# EAGLE design illucia_dtr_teensy_v1.0 (EAGLE 5.10)
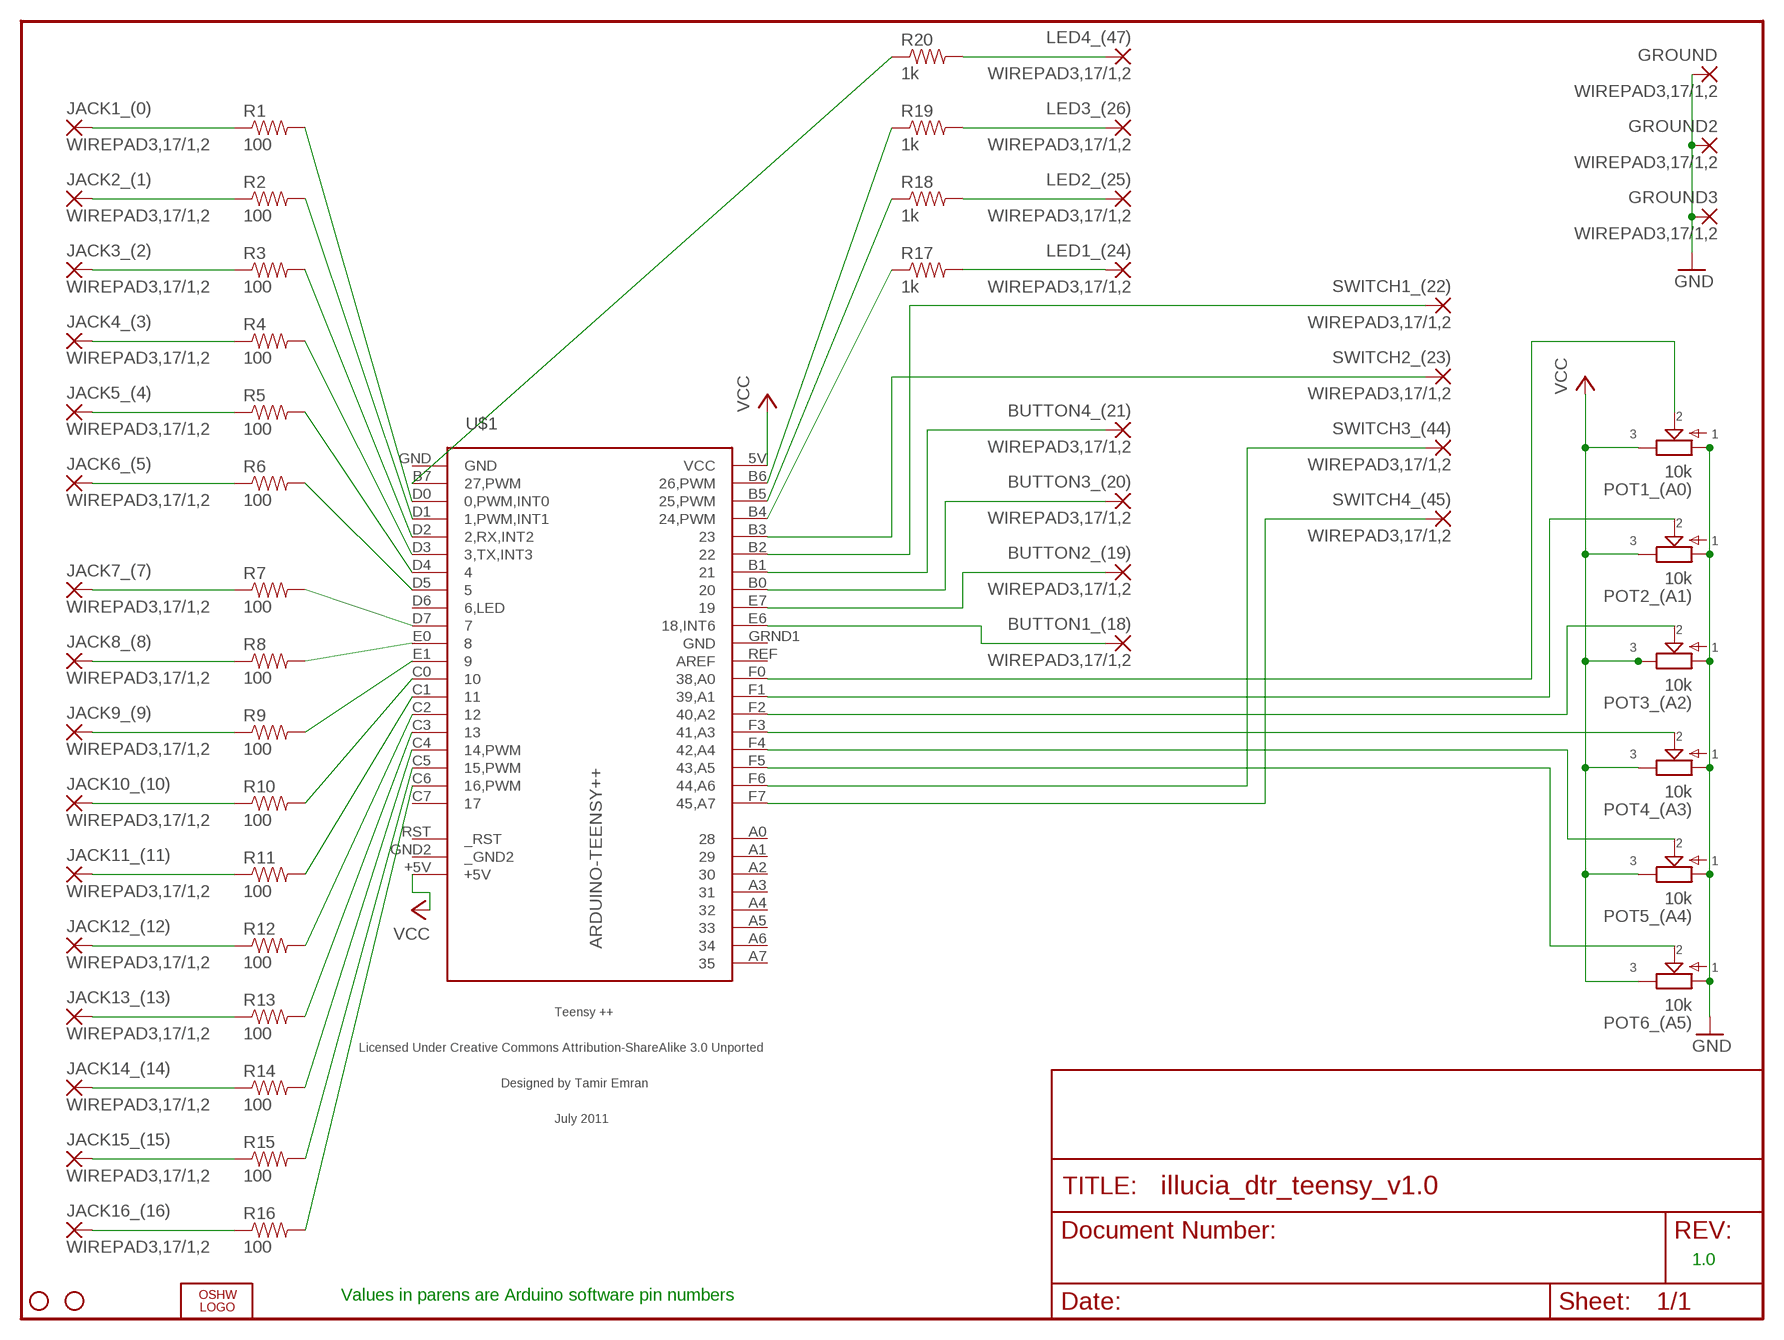
[diagram p0: schematic, sheet 1]

## Parts
BUTTON1_(18)  WIREPAD3,17/1,2  [3,17/1,2]
BUTTON2_(19)  WIREPAD3,17/1,2  [3,17/1,2]
BUTTON3_(20)  WIREPAD3,17/1,2  [3,17/1,2]
BUTTON4_(21)  WIREPAD3,17/1,2  [3,17/1,2]
GROUND  WIREPAD3,17/1,2  [3,17/1,2]
GROUND2  WIREPAD3,17/1,2  [3,17/1,2]
GROUND3  WIREPAD3,17/1,2  [3,17/1,2]
JACK1_(0)  WIREPAD3,17/1,2  [3,17/1,2]
JACK2_(1)  WIREPAD3,17/1,2  [3,17/1,2]
JACK3_(2)  WIREPAD3,17/1,2  [3,17/1,2]
JACK4_(3)  WIREPAD3,17/1,2  [3,17/1,2]
JACK5_(4)  WIREPAD3,17/1,2  [3,17/1,2]
JACK6_(5)  WIREPAD3,17/1,2  [3,17/1,2]
JACK7_(7)  WIREPAD3,17/1,2  [3,17/1,2]
JACK8_(8)  WIREPAD3,17/1,2  [3,17/1,2]
JACK9_(9)  WIREPAD3,17/1,2  [3,17/1,2]
JACK10_(10)  WIREPAD3,17/1,2  [3,17/1,2]
JACK11_(11)  WIREPAD3,17/1,2  [3,17/1,2]
JACK12_(12)  WIREPAD3,17/1,2  [3,17/1,2]
JACK13_(13)  WIREPAD3,17/1,2  [3,17/1,2]
JACK14_(14)  WIREPAD3,17/1,2  [3,17/1,2]
JACK15_(15)  WIREPAD3,17/1,2  [3,17/1,2]
JACK16_(16)  WIREPAD3,17/1,2  [3,17/1,2]
JP1  STAND-OFF  [STAND-OFF]
JP4  STAND-OFF  [STAND-OFF]
LED1_(24)  WIREPAD3,17/1,2  [3,17/1,2]
LED2_(25)  WIREPAD3,17/1,2  [3,17/1,2]
LED3_(26)  WIREPAD3,17/1,2  [3,17/1,2]
LED4_(47)  WIREPAD3,17/1,2  [3,17/1,2]
LOGO1  OSHW_LOGO_FILLX0350-NT  [OSHW_FILLX350_NOTEXT]
POT1_(A0)  10k  POT-EU16MM  [16MM]
POT2_(A1)  10k  POT-EU16MM  [16MM]
POT3_(A2)  10k  POT-EU16MM  [16MM]
POT4_(A3)  10k  POT-EU16MM  [16MM]
POT5_(A4)  10k  POT-EU16MM  [16MM]
POT6_(A5)  10k  POT-EU16MM  [16MM]
R1  100  RESISTORAXIAL-0.3  [AXIAL-0.3]
R2  100  RESISTORAXIAL-0.3  [AXIAL-0.3]
R3  100  RESISTORAXIAL-0.3  [AXIAL-0.3]
R4  100  RESISTORAXIAL-0.3  [AXIAL-0.3]
R5  100  RESISTORAXIAL-0.3  [AXIAL-0.3]
R6  100  RESISTORAXIAL-0.3  [AXIAL-0.3]
R7  100  RESISTORAXIAL-0.3  [AXIAL-0.3]
R8  100  RESISTORAXIAL-0.3  [AXIAL-0.3]
R9  100  RESISTORAXIAL-0.3  [AXIAL-0.3]
R10  100  RESISTORAXIAL-0.3  [AXIAL-0.3]
R11  100  RESISTORAXIAL-0.3  [AXIAL-0.3]
R12  100  RESISTORAXIAL-0.3  [AXIAL-0.3]
R13  100  RESISTORAXIAL-0.3  [AXIAL-0.3]
R14  100  RESISTORAXIAL-0.3  [AXIAL-0.3]
R15  100  RESISTORAXIAL-0.3  [AXIAL-0.3]
R16  100  RESISTORAXIAL-0.3  [AXIAL-0.3]
R17  1k  RESISTORAXIAL-0.3  [AXIAL-0.3]
R18  1k  RESISTORAXIAL-0.3  [AXIAL-0.3]
R19  1k  RESISTORAXIAL-0.3  [AXIAL-0.3]
R20  1k  RESISTORAXIAL-0.3  [AXIAL-0.3]
SWITCH1_(22)  WIREPAD3,17/1,2  [3,17/1,2]
SWITCH2_(23)  WIREPAD3,17/1,2  [3,17/1,2]
SWITCH3_(44)  WIREPAD3,17/1,2  [3,17/1,2]
SWITCH4_(45)  WIREPAD3,17/1,2  [3,17/1,2]
U$1  ARDUINO-TEENSY++  [TEENSY++]

## Nets
GND: GROUND2.1(P) GROUND3.1(P) GROUND.1(P) POT1_(A0).1 POT2_(A1).1 POT3_(A2).1 POT4_(A3).1 POT5_(A4).1 POT6_(A5).1
N$1: R20.P$1 U$1.B7(27,PWM)
N$2: R1.P$2 U$1.D0(0,PWM,INT0)
N$3: R3.P$2 U$1.D2(2,RX,INT2)
N$4: R4.P$2 U$1.D3(3,TX,INT3)
N$5: R5.P$2 U$1.D4
N$6: R6.P$2 U$1.D5
N$7: R7.P$2 U$1.D7
N$8: R8.P$2 U$1.E0
N$9: R9.P$2 U$1.E1
N$10: R10.P$2 U$1.C0
N$11: R11.P$2 U$1.C1
N$12: R12.P$2 U$1.C2
N$13: R2.P$2 U$1.D1(1,PWM,INT1)
N$14: R13.P$2 U$1.C3
N$15: R14.P$2 U$1.C4(14,PWM)
N$16: R15.P$2 U$1.C5(15,PWM)
N$17: R16.P$2 U$1.C6(16,PWM)
N$18: R19.P$1 U$1.B6(26,PWM)
N$19: R18.P$1 U$1.B5(25,PWM)
N$20: R17.P$1 U$1.B4(24,PWM)
N$21: LED4_(47).1(P) R20.P$2
N$22: LED3_(26).1(P) R19.P$2
N$23: LED2_(25).1(P) R18.P$2
N$24: LED1_(24).1(P) R17.P$2
N$25: POT1_(A0).2 U$1.F0(38,A0)
N$26: POT2_(A1).2 U$1.F1(39,A1)
N$27: POT3_(A2).2 U$1.F2(40,A2)
N$28: POT4_(A3).2 U$1.F3(41,A3)
N$29: POT5_(A4).2 U$1.F4(42,A4)
N$30: POT6_(A5).2 U$1.F5(43,A5)
N$31: BUTTON1_(18).1(P) U$1.E6(18,INT6)
N$32: BUTTON2_(19).1(P) U$1.E7
N$33: BUTTON3_(20).1(P) U$1.B0
N$34: BUTTON4_(21).1(P) U$1.B1
N$35: SWITCH2_(23).1(P) U$1.B3
N$36: JACK6_(5).1(P) R6.P$1
N$37: JACK7_(7).1(P) R7.P$1
N$38: JACK8_(8).1(P) R8.P$1
N$40: SWITCH1_(22).1(P) U$1.B2
N$44: JACK14_(14).1(P) R14.P$1
N$45: JACK15_(15).1(P) R15.P$1
N$46: JACK16_(16).1(P) R16.P$1
N$47: JACK1_(0).1(P) R1.P$1
N$48: JACK2_(1).1(P) R2.P$1
N$49: JACK3_(2).1(P) R3.P$1
N$50: JACK4_(3).1(P) R4.P$1
N$51: JACK5_(4).1(P) R5.P$1
N$53: SWITCH3_(44).1(P) U$1.F6(44,A6)
N$54: SWITCH4_(45).1(P) U$1.F7(45,A7)
N$55: JACK9_(9).1(P) R9.P$1
N$56: JACK10_(10).1(P) R10.P$1
N$57: JACK11_(11).1(P) R11.P$1
N$58: JACK12_(12).1(P) R12.P$1
N$59: JACK13_(13).1(P) R13.P$1
VCC: POT1_(A0).3 POT2_(A1).3 POT3_(A2).3 POT4_(A3).3 POT5_(A4).3 POT6_(A5).3 U$1.5V(VCC) U$1.+5V
Unconnected: U$1.A0 U$1.A1 U$1.A2 U$1.A3 U$1.A4 U$1.A5 U$1.A6 U$1.A7 U$1.C7 U$1.D6(6,LED) U$1.REF(AREF) U$1.RST(_RST)

## Notes on the sheet
- 1.0
- Values in parens are Arduino software pin numbers

## Power pins joined to a net without a drawn wire
_GND2: U$1.GND2(_GND2)
GND: U$1.GND U$1.GRND1(GND)

## Library data of the parts
BUTTON1_(18) BUTTON2_(19) BUTTON3_(20) BUTTON4_(21) GROUND GROUND2 GROUND3 JACK1_(0) JACK2_(1) JACK3_(2) JACK4_(3) JACK5_(4) JACK6_(5) JACK7_(7) JACK8_(8) JACK9_(9) JACK10_(10) JACK11_(11) JACK12_(12) JACK13_(13) JACK14_(14) JACK15_(15) JACK16_(16) LED1_(24) LED2_(25) LED3_(26) LED4_(47) SWITCH1_(22) SWITCH2_(23) SWITCH3_(44) SWITCH4_(45) = wirepad:WIREPAD: Wire PAD connect wire on PCB
JP1 JP4 = SparkFun:STAND-OFF: Stand Off This is the mechanical footprint for a #4 phillips button head screw. Use the keepout ring to avoid running the screw head into surrounding components. SKU : PRT-00447
LOGO1 = OSHW:OSHW_LOGO_FILL
POT1_(A0) POT2_(A1) POT3_(A2) POT4_(A3) POT5_(A4) POT6_(A5) = !parts_I_built:POT-EU
R1-R20 = SparkFun:RESISTOR: Resistor Basic schematic elements and footprints for 0603, 1206, and PTH resistors.
U$1 = !parts_I_built:ARDUINO-TEENSY++: Teensy ++ Original Design by Mark Gross Modified Design by Tamir Emran Licensed Under Creative Commons Attribution-ShareAlike 3.0 Unported (CC BY-SA 3.0)

## Board
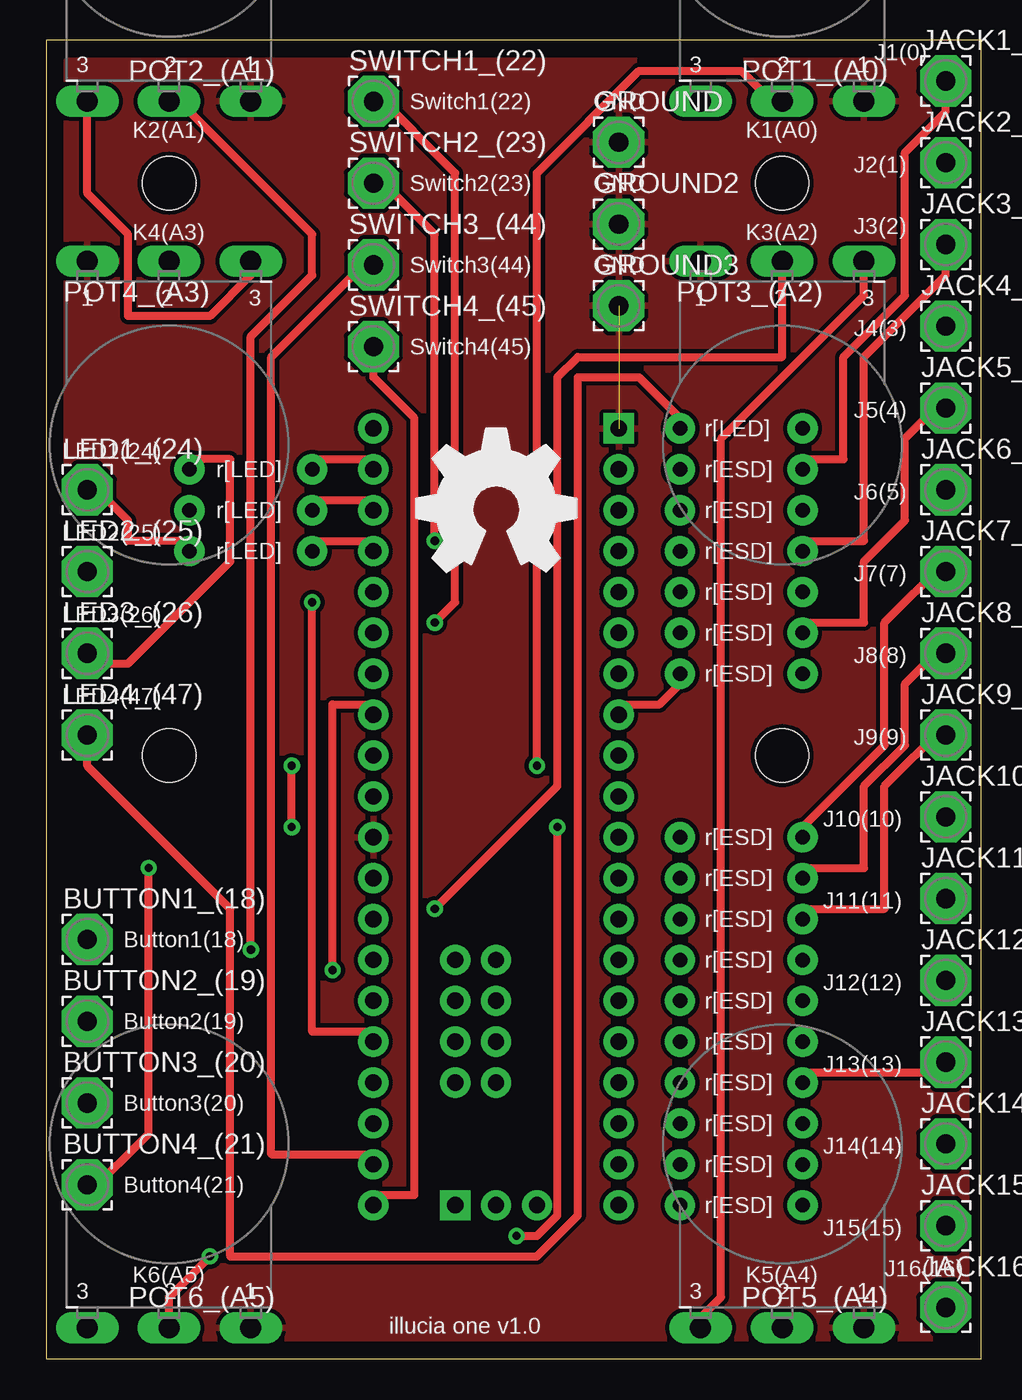
[diagram p1: board, top side]
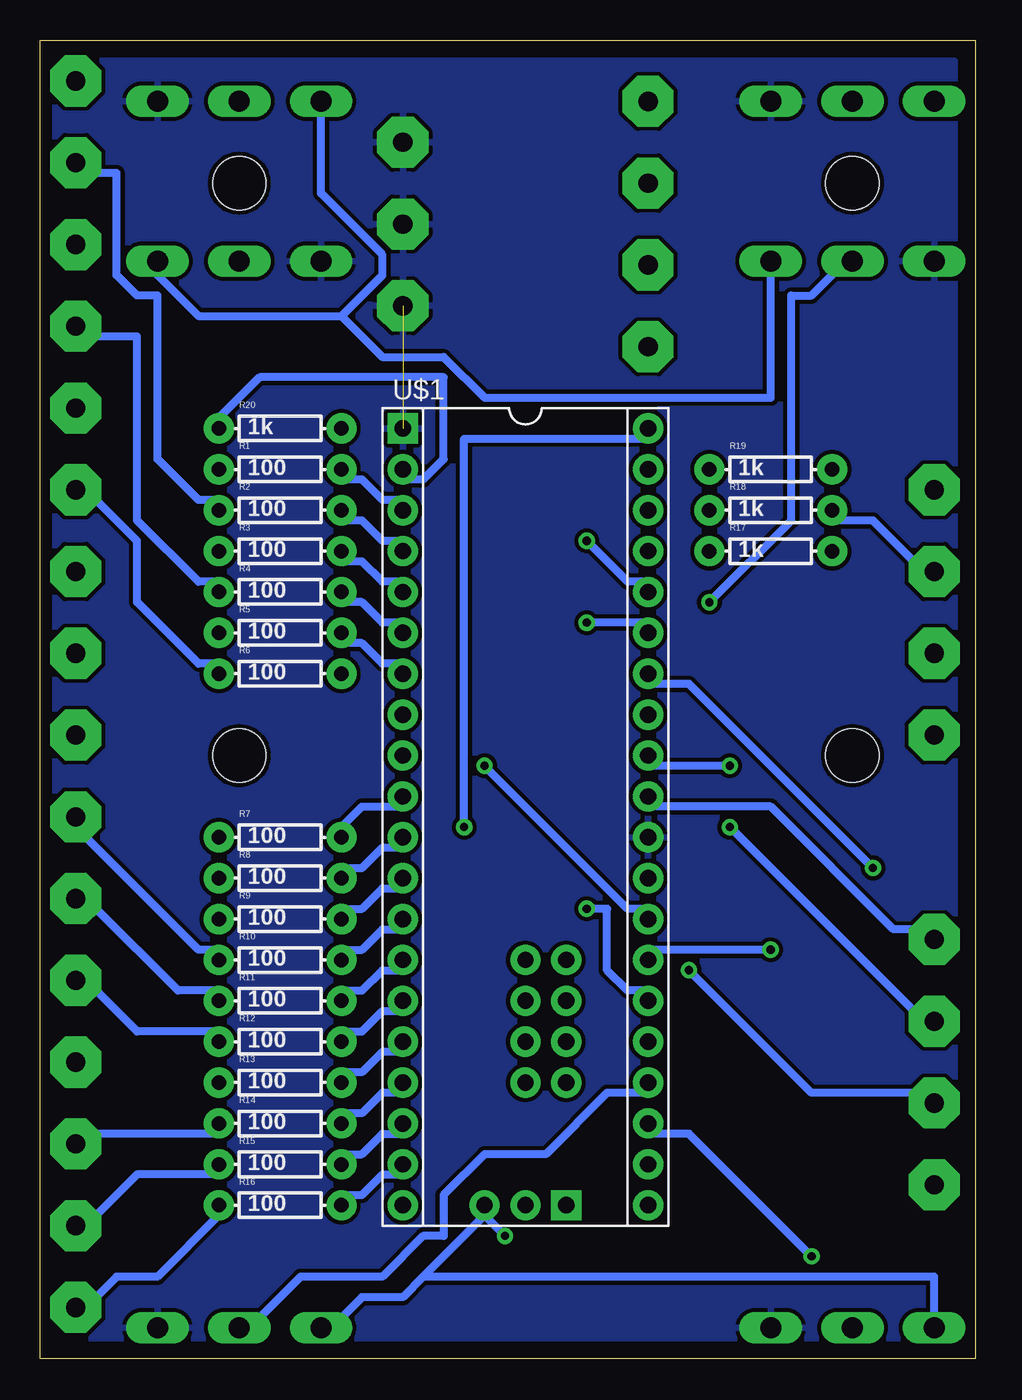
[diagram p2: board, bottom side, seen from below]

Size 58.09 x 81.91 mm. Coordinates in mm from the lower left corner, seen from the top.
Outline: 0,0 58.09,0 58.09,81.91 0,81.91 0,0
Copper layers (1*16): Top 0.035mm / dielectric 1.5mm / Bottom 0.035mm
Design rules "BatchPcb (Production) *": minimum track width 20mil, minimum drill 20mil, track to track 10mil, track to pad 10mil, pad to pad 4mil, via to via 8mil, smd to smd 4mil, copper to edge 10mil, drill to drill 8mil, minimum pad ring 12mil, minimum via ring 10mil, stop-mask expansion 4mil, vias tented up to drill 25mil, thermal gap 10mil

### Footprints (pad centres in the part's own frame; a part is rotated, then mirrored left to right if it is on the bottom)
3,17/1,2 = drill 1.194 pad 3.175 octagon: 1 0,0
STAND-OFF = hole 3.302: 0,0
16MM = drill 1.3 long: 1 5.08,0; 2 0,0; 3 -5.08,0
AXIAL-0.3 = drill 0.9 pad 1.88 round: P$1 -3.81,0; P$2 3.81,0
TEENSY++ = drill 1.016 pad 1.88 round: 5V 24.13,-2.54; +5V -24.13,7.62; A0 8.89,0; A1 11.43,0; A2 13.97,0; A3 16.51,0; A4 8.89,2.54; A5 11.43,2.54; A6 13.97,2.54; A7 16.51,2.54; B0 -6.35,7.62; B1 -8.89,7.62; B2 -11.43,7.62; B3 -13.97,7.62; B4 -16.51,7.62; B5 -19.05,7.62; B6 -21.59,7.62; B7 -21.59,-7.62; C0 6.35,-7.62; C1 8.89,-7.62; C2 11.43,-7.62; C3 13.97,-7.62; C4 16.51,-7.62; C5 19.05,-7.62; C6 21.59,-7.62; C7 24.13,-7.62; D0 -19.05,-7.62; D1 -16.51,-7.62; D2 -13.97,-7.62; D3 -11.43,-7.62; D4 -8.89,-7.62; D5 -6.35,-7.62; D6 -3.81,-7.62; D7 -1.27,-7.62; E0 1.27,-7.62; E1 3.81,-7.62; E6 -1.27,7.62; E7 -3.81,7.62; F0 6.35,7.62; F1 8.89,7.62; F2 11.43,7.62; F3 13.97,7.62; F4 16.51,7.62; F5 19.05,7.62; F6 21.59,7.62; F7 24.13,7.62; GND2 24.13,0; GRND1 1.27,7.62; REF 3.81,7.62 | drill 1.016 pad 1.88 square: GND -24.13,-7.62; RST 24.13,2.54

### Placement (x,y rotation side)
BUTTON1_(18)  2.54,26.04 0 top
BUTTON2_(19)  2.54,20.95 0 top
BUTTON3_(20)  2.54,15.88 0 top
BUTTON4_(21)  2.54,10.79 0 top
GROUND  35.56,75.56 0 top
GROUND2  35.56,70.48 0 top
GROUND3  35.56,65.41 0 top
JACK1_(0)  55.88,79.38 0 top
JACK2_(1)  55.88,74.3 0 top
JACK3_(2)  55.88,69.22 0 top
JACK4_(3)  55.88,64.14 0 top
JACK5_(4)  55.88,59.05 0 top
JACK6_(5)  55.88,53.98 0 top
JACK7_(7)  55.88,48.9 0 top
JACK8_(8)  55.88,43.81 0 top
JACK9_(9)  55.88,38.73 0 top
JACK10_(10)  55.88,33.66 0 top
JACK11_(11)  55.88,28.57 0 top
JACK12_(12)  55.88,23.5 0 top
JACK13_(13)  55.88,18.41 0 top
JACK14_(14)  55.88,13.34 0 top
JACK15_(15)  55.88,8.26 0 top
JACK16_(16)  55.88,3.17 0 top
JP1  45.72,37.47 0 top
JP2  STAND-OFF  [STAND-OFF]  7.62,73.03 0 top
JP3  STAND-OFF  [STAND-OFF]  45.72,73.03 0 top
JP4  7.62,37.47 0 top
LED1_(24)  2.54,53.98 0 top
LED2_(25)  2.54,48.9 0 top
LED3_(26)  2.54,43.81 0 top
LED4_(47)  2.54,38.73 0 top
LOGO1  22.99,48.9 0 top
POT1_(A0)  45.72,78.11 0 top
POT2_(A1)  7.62,78.11 0 top
POT3_(A2)  45.72,68.18 180 top
POT4_(A3)  7.62,68.18 180 top
POT5_(A4)  45.72,1.91 0 top
POT6_(A5)  7.62,1.91 0 top
R1  43.18,55.24 0 bottom
R2  43.18,52.7 0 bottom
R3  43.18,50.16 0 bottom
R4  43.18,47.62 0 bottom
R5  43.18,45.09 0 bottom
R6  43.18,42.55 0 bottom
R7  43.18,32.38 0 bottom
R8  43.18,29.84 0 bottom
R9  43.18,27.3 0 bottom
R10  43.18,24.77 0 bottom
R11  43.18,22.23 0 bottom
R12  43.18,19.68 0 bottom
R13  43.18,17.14 0 bottom
R14  43.18,14.61 0 bottom
R15  43.18,12.06 0 bottom
R16  43.18,9.53 0 bottom
R17  12.7,50.16 0 bottom
R18  12.7,52.7 0 bottom
R19  12.7,55.24 0 bottom
R20  43.18,57.78 0 bottom
SWITCH1_(22)  20.32,78.11 0 top
SWITCH2_(23)  20.32,73.03 0 top
SWITCH3_(44)  20.32,67.94 0 top
SWITCH4_(45)  20.32,62.87 0 top
U$1  27.94,33.66 270 bottom

### Tracks (layer width: path | path; a pad name or v marks a point on that pad's centre or on a via)
GND  (1 unrouted)
  pour Bottom: 57.15,80.64 1.27,80.64 1.27,1.27 57.15,1.27
  pour Top: 57.15,80.64 1.27,80.64 1.27,1.27 57.15,1.27
N$1
  Bottom 0.508: U$1.B7 35.56,54.61 34.29,54.61 33.02,55.88 33.02,60.96 44.45,60.96 46.99,58.42 R20.P$1
N$2
  Bottom 0.508: U$1.D0 35.56,53.34 36.83,53.34 38.1,54.61 39.37,54.61 R1.P$2
N$3
  Bottom 0.508: U$1.D2 35.56,48.26 36.83,48.26 38.1,49.53 39.37,49.53 R3.P$2
N$4
  Bottom 0.508: U$1.D3 35.56,45.72 36.83,45.72 38.1,46.99 39.37,46.99 R4.P$2
N$5
  Bottom 0.508: U$1.D4 35.56,43.18 36.83,43.18 38.1,44.45 39.37,44.45 R5.P$2
N$6
  Top 0.508: U$1.D5 35.56,40.64 38.1,40.64 39.37,41.91 R6.P$2
N$7
  Bottom 0.508: R7.P$2 39.37,33.02 38.1,34.29 35.56,34.29 U$1.D7
N$8
  Bottom 0.508: R8.P$2 39.37,30.48 38.1,30.48 36.83,31.75 35.56,31.75 U$1.E0
N$9
  Bottom 0.508: R9.P$2 39.37,27.94 38.1,27.94 36.83,29.21 35.56,29.21 U$1.E1
N$10
  Bottom 0.508: R10.P$2 39.37,25.4 38.1,25.4 36.83,26.67 35.56,26.67 U$1.C0
N$11
  Bottom 0.508: R11.P$2 39.37,22.86 38.1,22.86 36.83,24.13 35.56,24.13 U$1.C1
N$12
  Bottom 0.508: R12.P$2 39.37,20.32 38.1,20.32 36.83,21.59 35.56,21.59 U$1.C2
N$13
  Bottom 0.508: U$1.D1 35.56,50.8 36.83,50.8 38.1,52.07 39.37,52.07 R2.P$2
N$14
  Bottom 0.508: U$1.C3 35.56,19.05 36.83,19.05 38.1,17.78 39.37,17.78 R13.P$2
N$15
  Bottom 0.508: U$1.C4 35.56,16.51 36.83,16.51 38.1,15.24 39.37,15.24 R14.P$2
N$16
  Bottom 0.508: R15.P$2 39.37,12.7 38.1,12.7 36.83,13.97 35.56,13.97 U$1.C5
N$17
  Bottom 0.508: R16.P$2 39.37,10.16 38.1,10.16 36.83,11.43 35.56,11.43 U$1.C6
N$18
  Top 0.508: R19.P$1 16.51,55.88 20.32,55.88 U$1.B6
N$19
  Top 0.508: R18.P$1 16.51,53.34 20.32,53.34 U$1.B5
N$20
  Top 0.508: R17.P$1 16.51,50.8 20.32,50.8 U$1.B4
N$21
  Top 0.508: R20.P$2 39.37,58.42 36.83,60.96 33.02,60.96 33.02,8.89 30.48,6.35 11.43,6.35 11.43,27.94 2.54,36.83 LED4_(47).1
N$22
  Top 0.508: R19.P$2 8.89,55.88 11.43,55.88 11.43,49.53 5.08,43.18 2.54,43.18 LED3_(26).1
N$23
  Bottom 0.508: R18.P$2 8.89,52.07 6.35,52.07 3.81,49.53 2.54,49.53 LED2_(25).1
N$24
  Top 0.508: R17.P$2 8.89,50.8 5.08,50.8 5.08,52.07 2.54,54.61 LED1_(24).1
N$25  (via drill 0.51)
  Top 0.508: v30.48,36.83 30.48,73.66 36.83,80.01 43.18,80.01 45.72,77.47 POT1_(A0).2
  Bottom 0.508: v30.48,36.83 21.59,27.94 20.32,27.94 U$1.F0
N$26  (via drill 0.51)
  Top 0.508: v12.7,25.4 12.7,63.5 16.51,67.31 16.51,69.85 7.62,78.74 POT2_(A1).2
  Bottom 0.508: v12.7,25.4 20.32,25.4 U$1.F1
N$27  (via drill 0.51)
  Top 0.508: v24.13,27.94 31.75,35.56 31.75,60.96 33.02,62.23 45.72,62.23 POT3_(A2).2
  Bottom 0.508: v24.13,27.94 22.86,27.94 22.86,24.13 21.59,22.86 20.32,22.86 U$1.F2
N$28  (via drill 0.51)
  Top 0.508: v16.51,46.99 16.51,20.32 20.32,20.32 U$1.F3
  Bottom 0.508: v16.51,46.99 11.43,52.07 11.43,66.04 10.16,66.04 8.89,67.31 8.89,68.58 7.62,68.58 POT4_(A3).2
N$29
  Bottom 0.508: U$1.F4 20.32,16.51 22.86,16.51 26.67,12.7 30.48,12.7 33.02,10.16 33.02,7.62 34.29,7.62 36.83,5.08 41.91,5.08 44.45,2.54 45.72,2.54 POT5_(A4).2
N$30  (via drill 0.51)
  Top 0.508: v10.16,6.35 7.62,3.81 POT6_(A5).2
  Bottom 0.508: v10.16,6.35 17.78,13.97 20.32,13.97 U$1.F5
N$31
  Bottom 0.508: U$1.E6 20.32,34.29 12.7,34.29 5.08,26.67 2.54,26.67 BUTTON1_(18).1
N$32  (via drill 0.51)
  Top 0.508: v15.24,33.02 v15.24,36.83
  Bottom 0.508: v15.24,36.83 20.32,36.83 U$1.E7 | v15.24,33.02 3.81,21.59 2.54,21.59 BUTTON2_(19).1
N$33  (via drill 0.51)
  Top 0.508: v17.78,24.13 17.78,40.64 20.32,40.64 U$1.B0
  Bottom 0.508: v17.78,24.13 10.16,16.51 2.54,16.51 BUTTON3_(20).1
N$34  (via drill 0.51)
  Top 0.508: v6.35,30.48 6.35,13.97 2.54,10.16 BUTTON4_(21).1
  Bottom 0.508: v6.35,30.48 17.78,41.91 20.32,41.91 U$1.B1
N$35  (via drill 0.51)
  Top 0.508: v24.13,50.8 24.13,69.85 20.32,73.66 SWITCH2_(23).1
  Bottom 0.508: v24.13,50.8 21.59,48.26 20.32,48.26 U$1.B3
N$36
  Bottom 0.508: R6.P$1 46.99,43.18 48.26,43.18 52.07,46.99 52.07,50.8 54.61,53.34 55.88,53.34 JACK6_(5).1
N$37
  Top 0.508: R7.P$1 46.99,33.02 52.07,38.1 52.07,45.72 55.88,49.53 JACK7_(7).1
N$38
  Top 0.508: R8.P$1 46.99,30.48 50.8,30.48 50.8,35.56 53.34,38.1 53.34,41.91 55.88,44.45 JACK8_(8).1
N$40  (via drill 0.51)
  Top 0.508: v24.13,45.72 25.4,46.99 25.4,73.66 20.32,78.74 SWITCH1_(22).1
  Bottom 0.508: v24.13,45.72 20.32,45.72 U$1.B2
N$44
  Bottom 0.508: R14.P$1 46.99,13.97 55.88,13.97 JACK14_(14).1
N$45
  Bottom 0.508: R15.P$1 46.99,11.43 52.07,11.43 54.61,8.89 55.88,8.89 JACK15_(15).1
N$46
  Bottom 0.508: R16.P$1 46.99,8.89 50.8,5.08 53.34,5.08 54.61,3.81 55.88,3.81 JACK16_(16).1
N$47
  Top 0.508: R1.P$1 46.99,55.88 49.53,55.88 49.53,62.23 53.34,66.04 53.34,74.93 55.88,77.47 JACK1_(0).1
N$48
  Bottom 0.508: R2.P$1 46.99,53.34 48.26,53.34 50.8,55.88 50.8,66.04 52.07,66.04 53.34,67.31 53.34,73.66 55.88,73.66 JACK2_(1).1
N$49
  Top 0.508: R3.P$1 46.99,50.8 50.8,50.8 50.8,62.23 55.88,67.31 JACK3_(2).1
N$50
  Bottom 0.508: R4.P$1 46.99,48.26 48.26,48.26 52.07,52.07 52.07,63.5 55.88,63.5 JACK4_(3).1
N$51
  Top 0.508: R5.P$1 46.99,45.72 50.8,45.72 50.8,49.53 53.34,52.07 53.34,57.15 55.88,59.69 JACK5_(4).1
N$53
  Top 0.508: U$1.F6 20.32,12.7 13.97,12.7 13.97,62.23 20.32,68.58 SWITCH3_(44).1
N$54
  Top 0.508: U$1.F7 20.32,10.16 22.86,10.16 22.86,58.42 20.32,60.96 SWITCH4_(45).1
N$55
  Top 0.508: R9.P$1 46.99,27.94 52.07,27.94 52.07,35.56 55.88,39.37 JACK9_(9).1
N$56
  Bottom 0.508: R10.P$1 46.99,25.4 48.26,25.4 55.88,33.02 JACK10_(10).1
N$57
  Bottom 0.508: R11.P$1 46.99,22.86 49.53,22.86 54.61,27.94 55.88,27.94 JACK11_(11).1
N$58
  Bottom 0.508: R12.P$1 46.99,20.32 52.07,20.32 54.61,22.86 55.88,22.86 JACK12_(12).1
N$59
  Top 0.508: R13.P$1 46.99,17.78 55.88,17.78 JACK13_(13).1
VCC  (via drill 0.51)
  Top 0.508: POT4_(A3).3 12.7,67.31 10.16,64.77 5.08,64.77 5.08,69.85 2.54,72.39 POT2_(A1).3 | POT5_(A4).3 40.64,2.54 41.91,3.81 41.91,57.15 50.8,66.04 POT3_(A2).3 | v29.21,7.62 30.48,7.62 31.75,8.89 v31.75,33.02
  Bottom 0.508: 34.29,5.08 35.56,3.81 38.1,3.81 39.37,2.54 40.64,2.54 POT5_(A4).3 | 34.29,5.08 30.48,8.89 | 34.29,5.08 2.54,5.08 POT6_(A5).3 | 39.37,64.77 48.26,64.77 50.8,67.31 POT3_(A2).3 | 39.37,64.77 36.83,67.31 36.83,68.58 40.64,72.39 POT1_(A0).3 | 39.37,64.77 36.83,62.23 33.02,62.23 30.48,59.69 12.7,59.69 POT4_(A3).3 | 30.48,8.89 v29.21,7.62 | v31.75,33.02 31.75,57.15 20.32,57.15 U$1.+5V | 30.48,8.89 U$1.5V

### Text on the board
tPlace: J1(0) | Switch1(22) | GND | K2(A1) | K1(A0) | J2(1) | Switch2(23) | GND | J3(2) | K4(A3) | K3(A2) | Switch3(44) | GND | J4(3) | Switch4(45) | J5(4) | r[LED] | LED1(24) | r[LED] | r[ESD] | J6(5) | r[LED] | r[ESD] | LED2(25) | r[LED] | r[ESD] | J7(7) | r[ESD] | LED3(26) | r[ESD] | J8(8) | r[ESD] | LED4(47) | J9(9) | J10(10) | r[ESD] | r[ESD] | J11(11) | r[ESD] | Button1(18) | r[ESD] | J12(12) | r[ESD] | Button2(19) | r[ESD] | J13(13) | r[ESD] | Button3(20) | r[ESD] | J14(14) | r[ESD] | Button4(21) | r[ESD] | J15(15) | K6(A5) | K5(A4) | J16(16) | illucia one v1.0